# EAGLE design EATremolo (EAGLE 6.5.0)
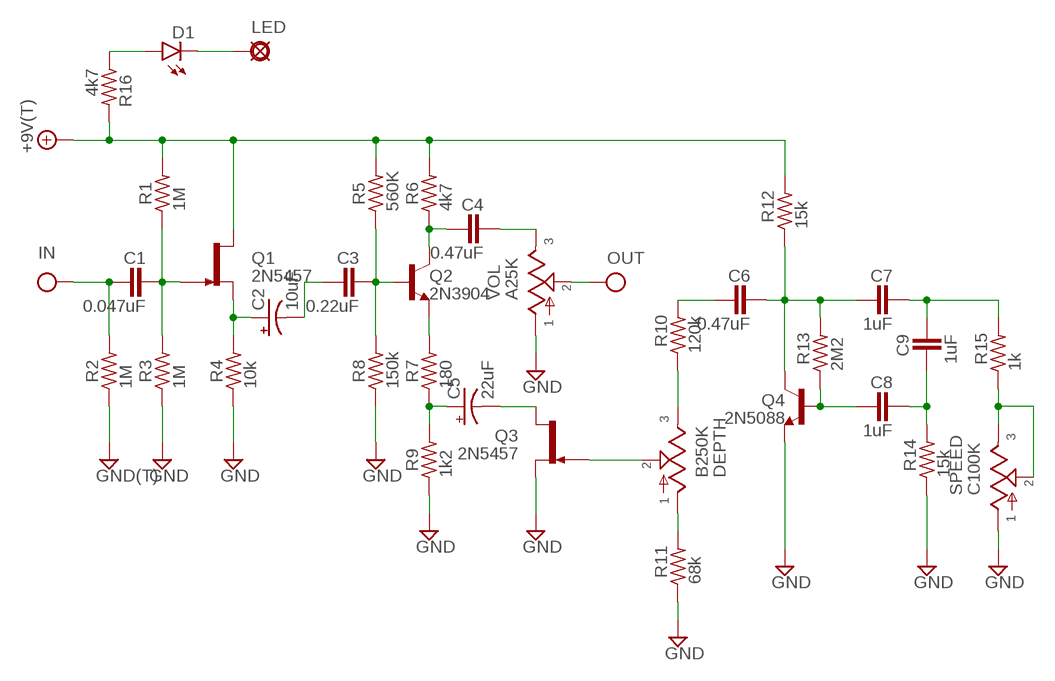
[diagram p0: schematic, sheet 1]

## Parts
+9V  +9V(T)  [SQUARE]
C1  0.047uF  072X0252  [072X025]
C2  10uF  0501  [050_020_1]
C3  0.22uF  072X0352  [072X035]
C4  0.47uF  072X0352  [072X035]
C5  22uF  0501  [050_020_1]
C6  0.47uF  072X0352  [072X035]
C7  1uF  072X0352  [072X035]
C8  1uF  072X0352  [072X035]
C9  1uF  072X0352  [072X035]
D1  LED3MM  [LED3MM]
DEPTH  B250K  POT  [POT]
GND  GND(T)  [SQUARE]
IN  IN(T)  [SQUARE]
LED  3mm  PAD  [SQUARE]
OUT  OUT(T)  [SQUARE]
Q1  2N5457  [TO92-]
Q2  2N3904  [TO92-]
Q3  2N5457  [TO92-]
Q4  2N5088  [TO92-]
R1  1M  6MM.3  [R0207/3]
R2  1M  6MM.3  [R0207/3]
R3  1M  6MM.3  [R0207/3]
R4  10k  6MM.3  [R0207/3]
R5  560K  6MM.3  [R0207/3]
R6  4k7  6MM.3  [R0207/3]
R7  180  6MM.3  [R0207/3]
R8  150k  6MM.3  [R0207/3]
R9  1k2  6MM.3  [R0207/3]
R10  120k  6MM.3  [R0207/3]
R11  68k  6MM.3  [R0207/3]
R12  15k  6MM.3  [R0207/3]
R13  2M2  6MM.3  [R0207/3]
R14  15k  6MM.3  [R0207/3]
R15  1k  6MM.3  [R0207/3]
R16  4k7  6MM.3  [R0207/3]
SPEED  C100K  POT  [POT]
VOL  A25K  POT  [POT]

## Nets
+9V: +9V.1(+9V) Q1.3(D) R1.2 R5.2 R6.2 R12.2 R16.2
GND: GND.1(GND) Q3.2(S) Q4.3(E) R2.1 R3.1 R4.1 R8.1 R9.1 R11.1 R14.1 SPEED.1 VOL.1
IN: C1.1 IN.1(IN) R2.2
N$1: C5.+ R7.1 R9.2
N$2: C1.2 Q1.1(G) R1.1 R3.2
N$3: D1.A R16.1
N$4: C2.+ Q1.2(S) R4.2
N$5: C4.1 Q2.1(C) R6.1
N$6: C2.- C3.1
N$7: C3.2 Q2.2(B) R5.1 R8.2
N$8: Q2.3(E) R7.2
N$9: C5.- Q3.3(D)
N$10: C4.2 VOL.3
N$11: DEPTH.2 Q3.1(G)
N$12: DEPTH.3 R10.1
N$13: DEPTH.1 R11.2
N$14: C6.1 R10.2
N$15: C6.2 C7.1 Q4.1(C) R12.1 R13.2
N$16: C8.1 Q4.2(B) R13.1
N$17: C7.2 C9.2 R15.2
N$18: C8.2 C9.1 R14.2
N$19: R15.1 SPEED.2 SPEED.3
N$20: D1.K(C) LED.1(PAD)
OUT: OUT.1(OUT) VOL.2

## Library data of the parts
+9V = mb_supply:+9V(T): +9V Voltage Supply use this to hook up +9v throughout a schematic instead of running wire automatically labels the net "+9v" adds a hookup pad to the circuit board
C1 = mb_caps-box:072X025: 1000pF - 0.47uF WIMA MKP2 63, 100V: 1000pF - 0.015uF; MKS2 50V: 0.33 - 0.47uF; 63V: 1000pF - 0.22uF;
C2 C5 = mb_caps-electro:050: 0.22 - 100uF Xicon values at Mouser.com: 10V: 10 - 100uF; 16V: 2.2 - 47uF; 25V: 0.47 - 47uF; 50V: 0.22 - 22uF
C3 C4 C6-C9 = mb_caps-box:072X035: 0.15 - 1.0uF; WIMA MKP2 63, 100V: 0.047uF; MKS2 50V: 0.68 - 1.0uF; 63V: 0.33 - 0.47uF; 100V: 0.15 - 0.22uF;
D1 = mb_diodes:LED
DEPTH SPEED VOL = mb_pots:POT: Potentiometers the arrow indicates the clockwise motion of th wiper (lug 2) fully counter clockwise there is no resistance between lugs 1 and 2 fully clockwise the resistance between lugs 1 and 2 is the value of the pot
GND = mb_supply:GND(T): Ground use this to hook up ground (GND) throughout a schematic instead of running wire automatically labels the net "GND" adds a hookup pad to the circuit board (you can use several)
IN = mb_supply:IN(T): Input obsolete: use Pad instead and label net shematic input label with circuit board terminal/pad generally used only once on a schematic (because this device labels the net "IN" in the same way as a voltage supply or ground net)
LED = mb_supply:PAD: PAD use this package for pads with any purpose, including input, output, send or return various pad shapes: round, square, octogonal, long, and long offset
OUT = mb_supply:OUT(T): Output obsolete: use Pad instead and label net output label with circuit board terminal/pad usually appears only once on a schematic
Q1 Q3 = mb_trans:2N5457: N-CHANNEL JFET
Q2 = mb_trans:2N3904: NPN Transistor
Q4 = mb_trans:2N5088: NPN Transistor
R1-R16 = mb_resistors:6MM: 6mm Resistors Leads spaced 1-6 holes apart for 0.1" perfboard. Suitable for 1/4 watt resistors.

## Board
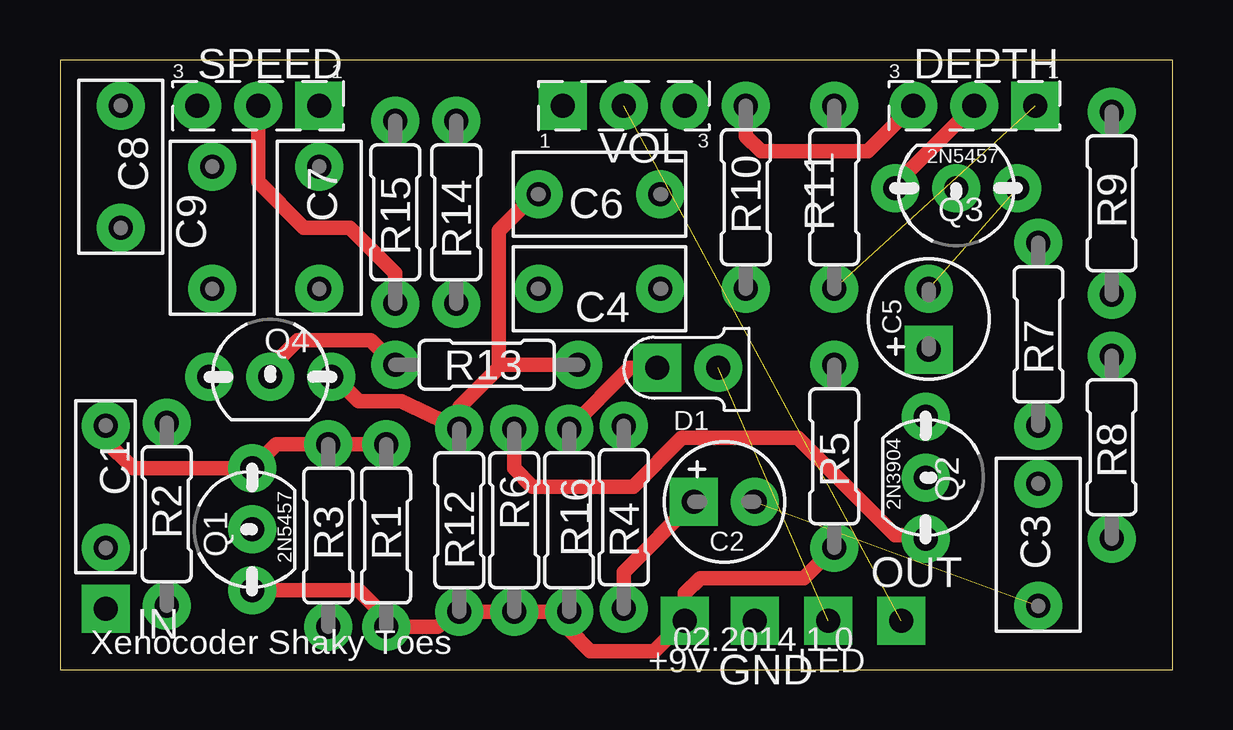
[diagram p1: board, top side]
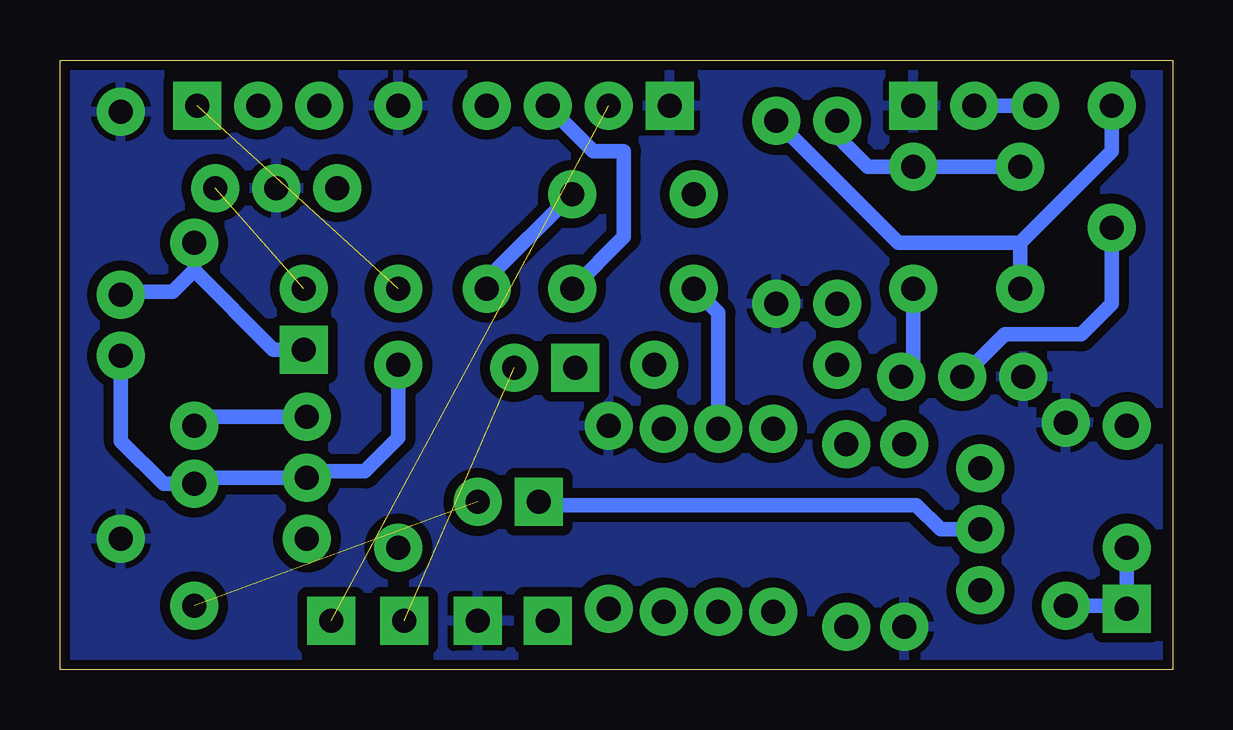
[diagram p2: board, bottom side, seen from below]

Size 46.35 x 25.4 mm. Coordinates in mm from the lower left corner, seen from the top.
Outline: 0,0 46.35,0 46.35,25.4 0,25.4 0,0
Copper layers (1*16): Top 0.0356mm / dielectric 1.5011mm / Bottom 0.0356mm
Design rules "LaenPCBOrder": minimum track width 6mil, minimum drill 13mil, track to track 6mil, track to pad 6mil, pad to pad 6mil, via to via 6mil, smd to smd 6mil, copper to edge 15mil, drill to drill 6mil, minimum pad ring 7mil, minimum via ring 7mil, stop-mask expansion 3mil, vias tented up to drill 0mil, thermal gap 10mil

### Footprints (pad centres in the part's own frame; a part is rotated, then mirrored left to right if it is on the bottom)
SQUARE = drill 1 pad 2 square: 1 0,0
072X025 = drill 1 pad 2: 1 -2.54,0; 2 2.54,0
050_020_1 = drill 1 pad 2 square: + -1.27,0 | drill 1 pad 2: - 1.27,0
072X035 = drill 1 pad 2: 1 -2.54,0; 2 2.54,0
LED3MM = drill 1 pad 2 square: A -1.27,0 | drill 1 pad 2: K 1.27,0
POT = drill 1 pad 2 square: 1 2.54,0 | drill 1 pad 2: 2 0,0; 3 -2.54,0
TO92- = drill 1 pad 2: 1 2.54,0; 2 0,0; 3 -2.54,0
R0207/3 = drill 1 pad 2: 1 -3.81,0; 2 3.81,0

### Placement (x,y rotation side)
+9V  26.04,2.03 0 top
C1  1.91,7.62 90 top
C2  27.69,6.99 0 top
C3  40.77,5.21 90 top
C4  22.48,15.88 0 top
C5  36.2,14.61 90 top
C6  22.48,19.81 180 top
C7  10.79,18.41 90 top
C8  2.54,20.95 90 top
C9  6.35,18.41 90 top
D1  26.16,12.57 0 top
DEPTH  38.1,23.5 0 top
GND  28.96,2.03 0 top
IN  1.91,2.54 0 top
LED  32,2.03 0 top
OUT  35.05,2.03 0 top
Q1  8,5.84 90 top
Q2  36.07,8 270 top
Q3  37.34,20.07 180 top
Q4  8.76,12.19 0 top
R1  13.59,5.59 270 top
R2  4.45,6.48 270 top
R3  11.18,5.59 90 top
R4  23.5,6.35 270 top
R5  32.26,8.89 270 top
R6  18.92,6.22 270 top
R7  40.77,13.97 270 top
R8  43.81,9.27 90 top
R9  43.81,19.43 270 top
R10  28.57,19.68 270 top
R11  32.26,19.68 270 top
R12  16.64,6.22 270 top
R13  17.78,12.7 0 top
R14  16.51,19.05 90 top
R15  13.97,19.05 90 top
R16  21.21,6.22 270 top
SPEED  8.26,23.5 0 top
VOL  23.5,23.5 180 top

### Tracks (layer width: path | path; a pad name or v marks a point on that pad's centre or on a via)
+9V
  Top 0.61: Q1.3 12.45,3.3 13.59,2.16 R1.2 15.75,1.78 R12.2 R6.2 R16.2 21.21,1.65 22.1,0.76 24.77,0.76 +9V.1 26.04,3.17 26.67,3.81 30.99,3.81 R5.2
GND
  pour Bottom (isolate 0.406): 0,25.4 46.23,25.4 46.23,0 0,0
IN
  Bottom 0.61: C1.1 IN.1 2.03,2.67 R2.2
N$1
  Bottom 0.61: R7.1 40.77,16.64 | 40.77,16.64 41.66,15.75 43.69,15.75 R9.2 | C5.+ 37.47,13.34 40.77,16.64
N$2
  Top 0.61: C1.2 1.91,9.53 3.05,8.38 Q1.1 9.02,9.4 R3.2 R1.1
N$3
  Top 0.61: R16.1 23.75,12.57 D1.A
N$4
  Top 0.61: R4.2 23.5,4.06 C2.+
  Bottom 0.61: Q1.2 9.65,5.84 10.67,6.86 26.29,6.86 C2.+
N$5
  Top 0.61: R6.1 18.92,8.38 19.68,7.62 23.88,7.62 25.91,9.65 30.73,9.65 34.8,5.59 35.94,5.59 Q2.1
  Bottom 0.61: R6.1 18.92,14.86 C4.1
N$6  (1 unrouted)
N$7
  Bottom 0.61: R8.2 43.81,9.53 42.04,7.75 C3.2 40.51,8 Q2.2 35.81,8.26 33.66,8.26 32.26,9.65 R5.1
N$8
  Bottom 0.61: Q2.3 40.39,10.54 R7.2
N$9  (1 unrouted)
N$10
  Bottom 0.61: C4.2 22.86,18.03 22.86,21.59 24.13,21.59 VOL.3
N$11
  Top 0.61: Q3.1 34.8,20.19 DEPTH.2
N$12
  Top 0.61: R10.1 28.57,22.23 29.21,21.59 33.66,21.59 DEPTH.3
N$13  (1 unrouted)
N$14
  Bottom 0.61: R10.2 28.57,16.26 C6.1
N$15
  Top 0.61: Q4.1 11.43,12.19 12.45,11.18 14.22,11.18 R12.1 16.64,10.92 18.1,12.38 18.29,12.57 | 18.29,12.57 18.41,12.7 R13.2 | C6.2 19.81,19.81 18.29,18.29 18.29,12.57
  Bottom 0.61: C7.1 10.79,12.7 Q4.1
N$16
  Top 0.61: Q4.2 8.76,12.57 9.91,13.72 12.95,13.72 R13.1
  Bottom 0.61: C8.1 2.54,15.24 3.81,13.97 6.99,13.97 Q4.2
N$17
  Bottom 0.61: R15.2 13.97,22.23 12.7,20.95 C7.2 C9.2
N$18
  Bottom 0.61: C9.1 6.35,17.78 | 6.35,17.78 2.54,21.59 C8.2 | R14.2 11.43,17.78 6.35,17.78
N$19
  Top 0.61: R15.1 13.97,16.51 12.06,18.41 10.16,18.41 8.26,20.32 SPEED.2
  Bottom 0.61: SPEED.2 SPEED.3
N$20  (1 unrouted)
OUT  (1 unrouted)

### Text on the board
tNames: Xenocoder Shaky Toes | 02.2014 1.0